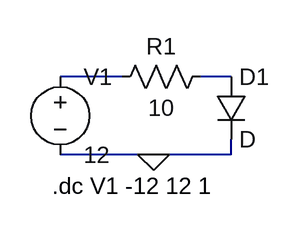
[diagram p0: schematic pnjuncdiode.asc]
pnjuncdiode.asc, the LTspice schematic file:
Version 4
SHEET 1 880 680
WIRE 144 176 80 176
WIRE 256 176 224 176
WIRE 176 256 80 256
WIRE 256 256 256 240
WIRE 256 256 176 256
FLAG 176 256 0
SYMBOL diode 240 176 R0
SYMATTR InstName D1
SYMBOL res 240 160 R90
WINDOW 0 0 56 VBottom 2
WINDOW 3 32 56 VTop 2
SYMATTR InstName R1
SYMATTR Value 10
SYMBOL voltage 80 160 R0
SYMATTR InstName V1
SYMATTR Value 12
TEXT 72 288 Left 2 !.dc V1 -12 12 1

The netlist it stands for:
* pnjuncdiode.asc
D1 N002 0 D
R1 N002 N001 10
V1 N001 0 12
.model D D
.lib standard.dio
.dc V1 -12 12 1
.backanno
.end